# EAGLE schematic m0xpdLooping ADSR v2.0 (EAGLE 9.6.2)
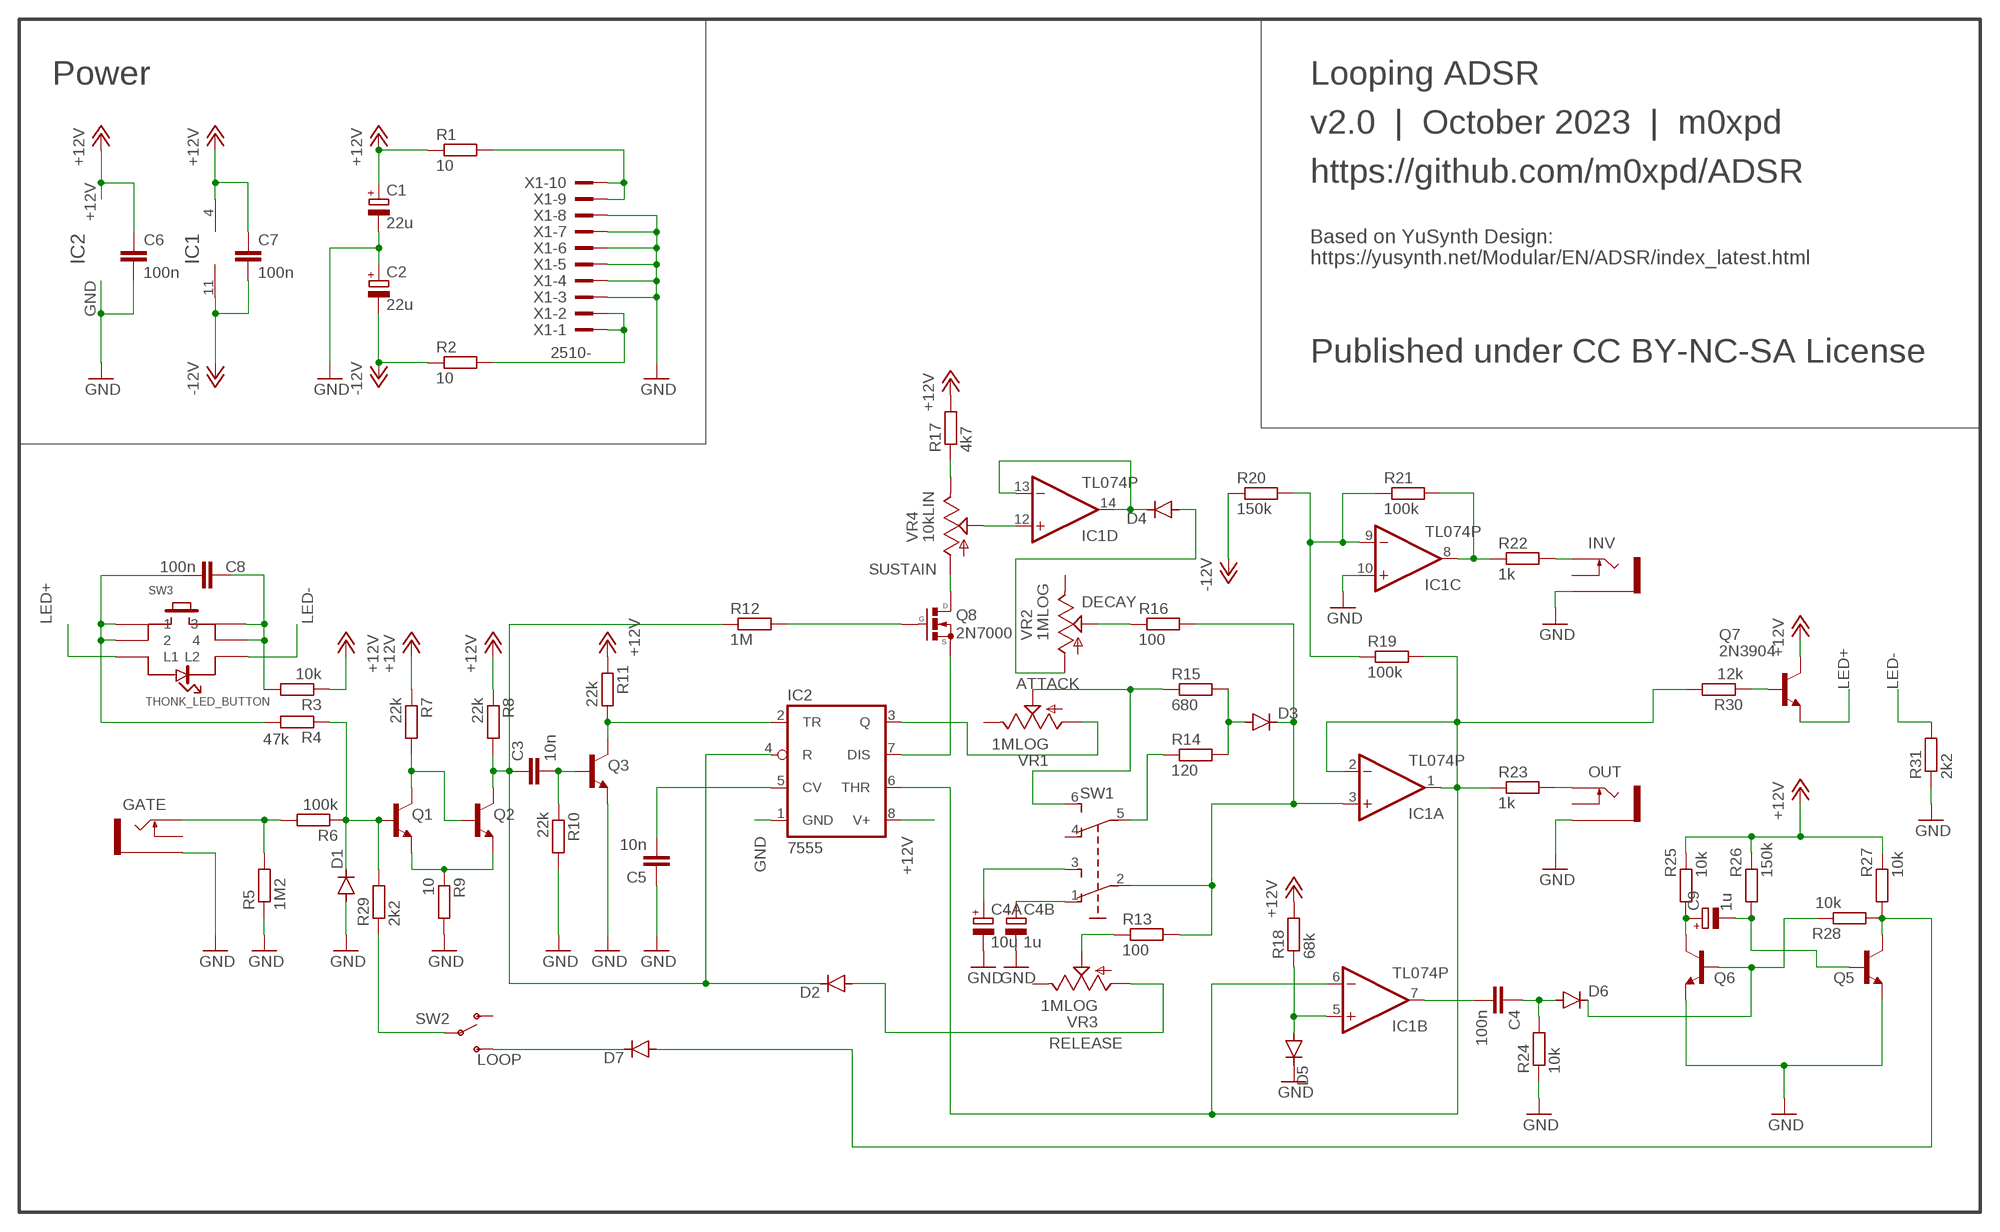
[diagram p0: schematic, sheet 1]

## Parts
C1  22u  CPOL-EUE2.5-5  [E2,5-5]
C2  22u  CPOL-EUE2.5-5  [E2,5-5]
C3  10n  C-EU050-025X075  [C050-025X075]
C4  100n  C-EU050-025X075  [C050-025X075]
C4A  10u  CPOL-EUE2.5-5  [E2,5-5]
C4B  1u  CPOL-EUE2.5-5  [E2,5-5]
C5  10n  C-EU050-025X075  [C050-025X075]
C6  100n  C-EU050-025X075  [C050-025X075]
C7  100n  C-EU050-025X075  [C050-025X075]
C8  100n  C-EU025-030X050  [C025-030X050]
C9  1u  CPOL-EUE2.5-5  [E2,5-5]
D1  1N4148DO35-7  [DO35-7]
D2  1N4148DO35-7  [DO35-7]
D3  1N4148DO35-7  [DO35-7]
D4  1N4148DO35-7  [DO35-7]
D5  1N4148DO35-7  [DO35-7]
D6  1N4148DO35-7  [DO35-7]
D7  1N4148DO35-7  [DO35-7]
GATE  THONKICONNNEW  [WQP-PJ301M-12_JACK]
IC1  TL074P  [DIL14]
IC2  7555  [DIL08]
INV  THONKICONNNEW  [WQP-PJ301M-12_JACK]
OUT  THONKICONNNEW  [WQP-PJ301M-12_JACK]
Q1  2N3904  [TO92]
Q2  2N3904  [TO92]
Q3  2N3904  [TO92]
Q5  2N3904  [TO92]
Q6  2N3904  [TO92]
Q7  2N3904  [TO92]
Q8  2N7000  [TO92]
R1  10  R-EU_0204/7  [0204/7]
R2  10  R-EU_0204/7  [0204/7]
R3  10k  R-EU_0204/7  [0204/7]
R4  47k  R-EU_0204/7  [0204/7]
R5  1M2  R-EU_0204/7  [0204/7]
R6  100k  R-EU_0204/7  [0204/7]
R7  22k  R-EU_0204/7  [0204/7]
R8  22k  R-EU_0204/7  [0204/7]
R9  10  R-EU_0204/7  [0204/7]
R10  22k  R-EU_0204/7  [0204/7]
R11  22k  R-EU_0204/7  [0204/7]
R12  1M  R-EU_0204/7  [0204/7]
R13  100  R-EU_0204/7  [0204/7]
R14  120  R-EU_0204/7  [0204/7]
R15  680  R-EU_0204/7  [0204/7]
R16  100  R-EU_0204/7  [0204/7]
R17  4k7  R-EU_0204/7  [0204/7]
R18  68k  R-EU_0204/7  [0204/7]
R19  100k  R-EU_0204/7  [0204/7]
R20  150k  R-EU_0204/7  [0204/7]
R21  100k  R-EU_0204/7  [0204/7]
R22  1k  R-EU_0204/7  [0204/7]
R23  1k  R-EU_0204/7  [0204/7]
R24  10k  R-EU_0204/7  [0204/7]
R25  10k  R-EU_0204/7  [0204/7]
R26  150k  R-EU_0204/7  [0204/7]
R27  10k  R-EU_0204/7  [0204/7]
R28  10k  R-EU_0204/7  [0204/7]
R29  2k2  R-EU_0204/7  [0204/7]
R30  12k  R-EU_0204/7  [0204/7]
R31  2k2  R-EU_0204/7  [0204/7]
SW1  TL46PO  [TL4XPO]
SW2  SUBMINI_SPDT  [SUBMINI_TOGGLE]
SW3  THONK_LED_BUTTON  [LOW_PROFILE_BUTTON]
VR1  1MLOG  9MM_SNAP-IN_POT_  [9MM_SNAP-IN_POT]
VR2  1MLOG  9MM_SNAP-IN_POT_  [9MM_SNAP-IN_POT]
VR3  1MLOG  9MM_SNAP-IN_POT_  [9MM_SNAP-IN_POT]
VR4  10kLIN  9MM_SNAP-IN_POT_  [9MM_SNAP-IN_POT]
X1  2510-  [PAK100/2500-10]

## Nets
+12V: C1.+ C6.1 C7.1 IC1.4(P:V+) IC2.8(V+) Q7.1(C) R1.1 R3.1 R7.1 R8.1 R11.1 R17.2 R18.2 R25.2 R26.2 R27.2
-12V: C2.- C7.2 IC1.11(P:V-) R2.1 R20.1
GND: C1.- C2.+ C4A.- C4B.- C5.1 C6.2 D1.A D5.C GATE.P$3_SLEEVE(SLEEVE) IC1.10(C:+IN) IC2.1(GND) INV.P$3_SLEEVE(SLEEVE) OUT.P$3_SLEEVE(SLEEVE) Q3.3(E) Q5.3(E) Q6.3(E) R5.1 R9.2 R10.2 R24.1 R31.1 X1.3 X1.4 X1.5 X1.6 X1.7 X1.8
LED+: Q7.3(E) SW3.L$1(L1)
LED-: R31.2 SW3.L$2(L2)
N$1: R1.2 X1.9 X1.10
N$2: GATE.P$1_TIP(TIP) R5.2 R6.2
N$3: D1.C Q1.2(B) R4.1 R6.1 R29.2
N$4: Q1.3(E) Q2.3(E) R9.1
N$5: R2.2 X1.1 X1.2
N$6: IC2.3(Q) VR1.1(A)
N$7: Q1.1(C) Q2.2(B) R7.2
N$8: C3.2 Q3.2(B) R10.1
N$9: IC2.2(TR) Q3.1(C) R11.2
N$10: C5.2 IC2.5(CV)
N$11: C3.1 D2.C IC2.4(R) Q2.1(C) R8.2 R12.1
N$12: Q8.2(G) R12.2
N$13: IC2.7(DIS) Q8.1(S)
N$14: D2.A VR3.1(A)
N$15: Q8.3(D) VR4.1(A)
N$16: R17.1 VR4.3(E)
N$17: R13.1 VR3.2(S)
N$18: R15.1 SW1.6(S1) VR1.2(S)
N$19: R14.1 SW1.5(P1)
N$20: D3.A R14.2 R15.2
N$21: D3.C IC1.3(A:+IN) R13.2 R16.2 SW1.2(P)
N$22: R16.1 VR2.2(S)
N$23: C4A.+ SW1.3(S)
N$24: C4B.+ SW1.1(O)
N$25: IC1.1(A:OUT) IC1.2(A:-IN) IC1.6(B:-IN) IC2.6(THR) R19.2 R23.1 R30.2
N$26: IC1.12(D:+IN) VR4.2(S)
N$27: D4.C IC1.13(D:-IN) IC1.14(D:OUT)
N$28: D4.A VR2.1(A)
N$29: D5.A IC1.5(B:+IN) R18.1
N$30: IC1.9(C:-IN) R19.1 R20.2 R21.1
N$31: C4.2 IC1.7(B:OUT)
N$32: IC1.8(C:OUT) R21.2 R22.1
N$33: INV.P$1_TIP(TIP) R22.2
N$34: OUT.P$1_TIP(TIP) R23.2
N$35: C8.1 R3.2 SW3.P$3 SW3.P$4
N$36: C8.2 R4.2 SW3.P$1 SW3.P$2
N$37: C4.1 D6.A R24.2
N$38: D7.A Q5.1(C) R27.1 R28.1
N$39: C9.+ Q6.1(C) R25.1
N$40: R29.1 SW2.COM(COMMON)
N$41: C9.- Q5.2(B) R26.1
N$42: D7.C SW2.3(S)
N$43: D6.C Q6.2(B) R28.2
N$45: Q7.2(B) R30.1
Unconnected: GATE.P$2_SWITCH(SWITCH) INV.P$2_SWITCH(SWITCH) OUT.P$2_SWITCH(SWITCH) SW1.4(O1) SW2.1(O) VR1.3(E) VR2.3(E) VR3.3(E)

## Notes on the sheet
- Power | Looping ADSR
- v2.0  |  October 2023  |  m0xpd
- https://github.com/m0xpd/ADSR
- IC2 | IC1
- Based on YuSynth Design:
  https://yusynth.net/Modular/EN/ADSR/index_latest.html
- Published under CC BY-NC-SA License
- SUSTAIN
- DECAY
- ATTACK
- RELEASE
- LOOP

## Library data of the parts
C1 C2 C4A C4B C9 = rcl:CPOL-EU: POLARIZED CAPACITOR, European symbol; SPICEPREFIX: C
C3-C8 = rcl:C-EU: CAPACITOR, European symbol; SPICEPREFIX: C
D1-D7 = diode:1N4148: DIODE high speed (Philips)
GATE INV OUT = MusicThingModular:THONKICONN: 3.5mm socket for Eurorack modular synths
IC1 = linear:TL074: OP AMP
IC2 = MyLibrary:7555: CMOS 555 timer
Q1-Q3 Q5-Q7 = transistor-npn:2N3904: NPN Transistor
Q8 = transistors-FET:2N7000: N-Channel Mosfet [S]-G-D pinout 2n7000: http://smallbear-electronics.mybigcommerce.com/transistor-fet-2n7000/
R1-R31 = rcl:R-EU_: RESISTOR, European symbol; SPICEPREFIX: R
SW1 = switch:TL46PO: TINY SWITCH ON - ON Source: http://www2.produktinfo.conrad.com/datenblaetter/700000-724999/705152-da-01-de-Subminiaturschalter_TL_36YO.pdf
SW2 = MyLibrary:SUBMINI_SPDT: Subminuature SPDT Toggle, THONK DW1
SW3 = MyLibrary:THONK_LED_BUTTON: Sleek low-profile illuminated button with a choice of LED colours https://www.thonk.co.uk/shop/low-profile-led-buttons/
VR1-VR4 = MusicThingModular:9MM_SNAP-IN_POT: 9mm vertical snap-in pot, Alpha / Panasonic style
X1 = con-3m:2510-: 3M (TM) Pak 100 4-Wall Header Source: 3M; MF: 3M; MPN: 2510-6002UB; OC_FARNELL: 9838244; OC_NEWARK: 46F4725